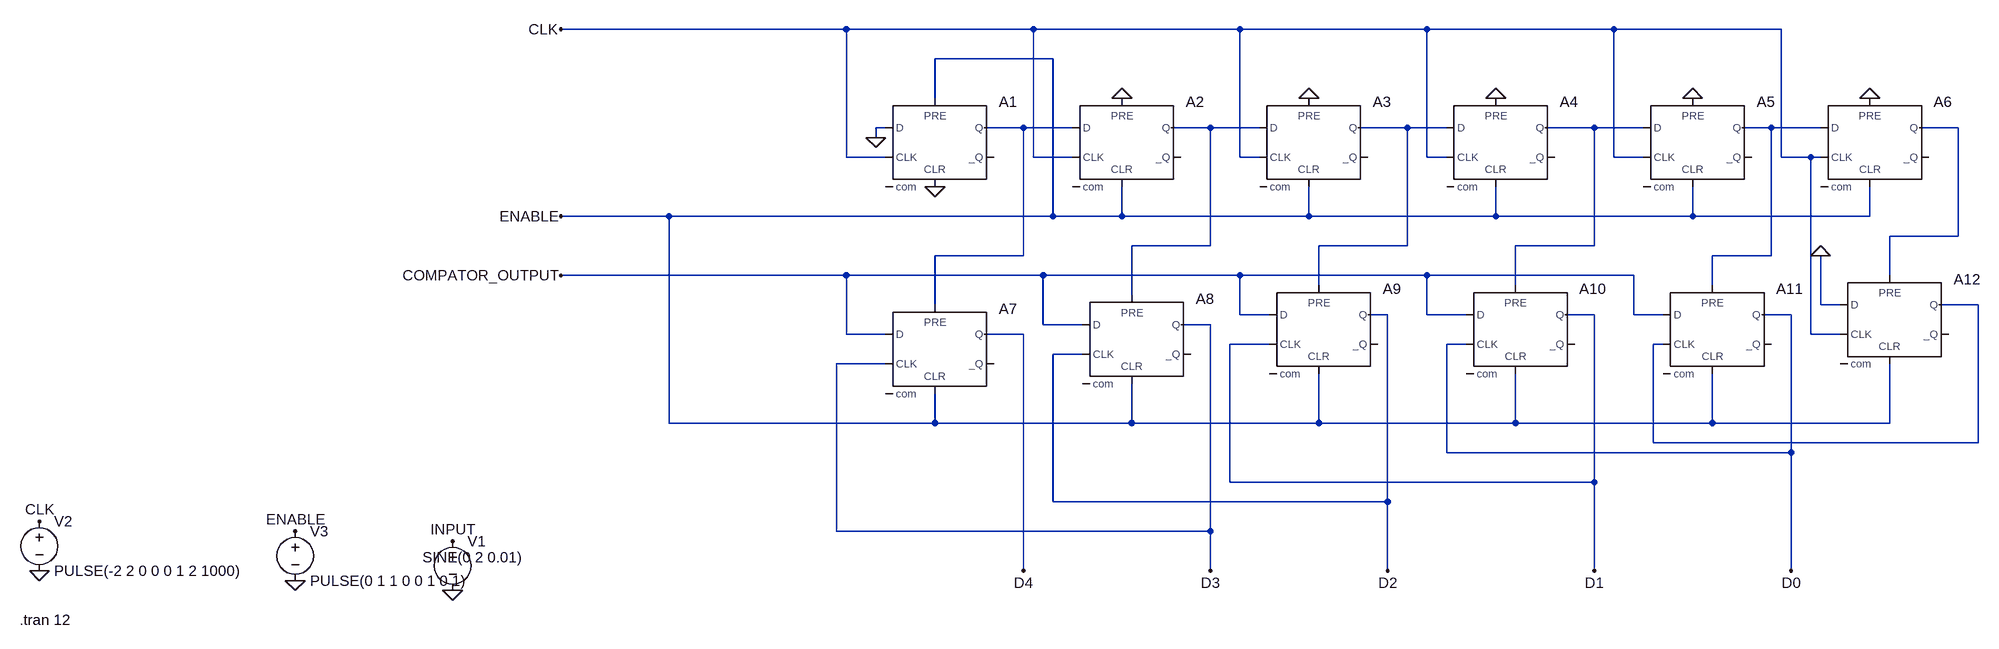
[diagram p0: schematic SAR.asc]
SAR.asc, the LTspice schematic file:
Version 4.1
SHEET 1 2516 848
WIRE 672 -128 208 -128
WIRE 976 -128 672 -128
WIRE 1312 -128 976 -128
WIRE 1616 -128 1312 -128
WIRE 1920 -128 1616 -128
WIRE 2192 -128 1920 -128
WIRE 1008 -80 816 -80
WIRE 816 -16 816 -80
WIRE 736 32 720 32
WIRE 960 32 896 32
WIRE 1040 32 960 32
WIRE 1264 32 1200 32
WIRE 1344 32 1264 32
WIRE 1584 32 1504 32
WIRE 1648 32 1584 32
WIRE 1888 32 1808 32
WIRE 1968 32 1888 32
WIRE 2176 32 2128 32
WIRE 2256 32 2176 32
WIRE 2480 32 2416 32
WIRE 720 48 720 32
WIRE 672 80 672 -128
WIRE 736 80 672 80
WIRE 976 80 976 -128
WIRE 1040 80 976 80
WIRE 1312 80 1312 -128
WIRE 1344 80 1312 80
WIRE 1616 80 1616 -128
WIRE 1648 80 1616 80
WIRE 1920 80 1920 -128
WIRE 1968 80 1920 80
WIRE 2192 80 2192 -128
WIRE 2240 80 2192 80
WIRE 2256 80 2240 80
WIRE 384 176 208 176
WIRE 1008 176 1008 -80
WIRE 1008 176 384 176
WIRE 1120 176 1120 128
WIRE 1120 176 1008 176
WIRE 1424 176 1424 128
WIRE 1424 176 1120 176
WIRE 1728 176 1728 128
WIRE 1728 176 1424 176
WIRE 2048 176 2048 128
WIRE 2048 176 1728 176
WIRE 2336 176 2336 128
WIRE 2336 176 2048 176
WIRE 2480 208 2480 32
WIRE 2480 208 2368 208
WIRE 1264 224 1264 32
WIRE 1264 224 1136 224
WIRE 1584 224 1584 32
WIRE 1584 224 1440 224
WIRE 1888 224 1888 32
WIRE 1888 224 1760 224
WIRE 960 240 960 32
WIRE 960 240 816 240
WIRE 2176 240 2176 32
WIRE 2176 240 2080 240
WIRE 672 272 208 272
WIRE 992 272 672 272
WIRE 1312 272 992 272
WIRE 1616 272 1312 272
WIRE 1952 272 1616 272
WIRE 2368 272 2368 208
WIRE 1440 288 1440 224
WIRE 1760 288 1760 224
WIRE 2080 288 2080 240
WIRE 1136 304 1136 224
WIRE 816 320 816 240
WIRE 2256 320 2256 240
WIRE 2288 320 2256 320
WIRE 2512 320 2448 320
WIRE 1312 336 1312 272
WIRE 1360 336 1312 336
WIRE 1552 336 1520 336
WIRE 1616 336 1616 272
WIRE 1680 336 1616 336
WIRE 1888 336 1840 336
WIRE 1952 336 1952 272
WIRE 2000 336 1952 336
WIRE 2208 336 2160 336
WIRE 992 352 992 272
WIRE 1056 352 992 352
WIRE 1264 352 1216 352
WIRE 672 368 672 272
WIRE 736 368 672 368
WIRE 960 368 896 368
WIRE 2240 368 2240 80
WIRE 2288 368 2240 368
WIRE 1360 384 1296 384
WIRE 1680 384 1648 384
WIRE 2000 384 1984 384
WIRE 1056 400 1008 400
WIRE 736 416 656 416
WIRE 384 512 384 176
WIRE 816 512 816 464
WIRE 816 512 384 512
WIRE 1136 512 1136 448
WIRE 1136 512 816 512
WIRE 1440 512 1440 432
WIRE 1440 512 1136 512
WIRE 1760 512 1760 432
WIRE 1760 512 1440 512
WIRE 2080 512 2080 432
WIRE 2080 512 1760 512
WIRE 2368 512 2368 416
WIRE 2368 512 2080 512
WIRE 1984 544 1984 384
WIRE 2512 544 2512 320
WIRE 2512 544 1984 544
WIRE 1648 560 1648 384
WIRE 2208 560 2208 336
WIRE 2208 560 1648 560
WIRE 1296 608 1296 384
WIRE 1888 608 1888 336
WIRE 1888 608 1296 608
WIRE 1008 640 1008 400
WIRE 1552 640 1552 336
WIRE 1552 640 1008 640
WIRE 656 688 656 416
WIRE 1264 688 1264 352
WIRE 1264 688 656 688
WIRE 960 752 960 368
WIRE 1264 752 1264 688
WIRE 1552 752 1552 640
WIRE 1888 752 1888 608
WIRE 2208 752 2208 560
FLAG 960 752 D4
FLAG 1264 752 D3
FLAG 1552 752 D2
FLAG 1888 752 D1
FLAG 2208 752 D0
FLAG 208 -128 CLK
FLAG 208 176 ENABLE
FLAG 208 272 COMPATOR_OUTPUT
FLAG 32 704 INPUT
FLAG 32 784 0
FLAG 816 128 0
FLAG 1120 -16 0
FLAG 1424 -16 0
FLAG 2336 -16 0
FLAG 2048 -16 0
FLAG 1728 -16 0
FLAG 2256 240 0
FLAG 720 48 0
FLAG -640 752 0
FLAG -224 768 0
FLAG -640 672 CLK
FLAG -224 688 ENABLE
SYMBOL Digital\\dflop 816 -16 R0
SYMATTR InstName A1
SYMBOL Digital\\dflop 1120 -16 R0
SYMATTR InstName A2
SYMBOL Digital\\dflop 1424 -16 R0
SYMATTR InstName A3
SYMBOL Digital\\dflop 1728 -16 R0
SYMATTR InstName A4
SYMBOL Digital\\dflop 2048 -16 R0
SYMATTR InstName A5
SYMBOL Digital\\dflop 2336 -16 R0
SYMATTR InstName A6
SYMBOL Digital\\dflop 816 320 R0
SYMATTR InstName A7
SYMBOL Digital\\dflop 1136 304 R0
SYMATTR InstName A8
SYMBOL Digital\\dflop 1440 288 R0
SYMATTR InstName A9
SYMBOL Digital\\dflop 1760 288 R0
SYMATTR InstName A10
SYMBOL Digital\\dflop 2080 288 R0
SYMATTR InstName A11
SYMBOL Digital\\dflop 2368 272 R0
SYMATTR InstName A12
SYMBOL voltage 32 688 R0
WINDOW 3 31 58 Bottom 2
WINDOW 123 0 0 Left 0
WINDOW 39 0 0 Left 0
SYMATTR Value SINE(0 2 0.01)
SYMATTR InstName V1
SYMBOL voltage -640 656 R0
WINDOW 123 0 0 Left 0
WINDOW 39 0 0 Left 0
SYMATTR InstName V2
SYMATTR Value PULSE(-2 2 0 0 0 1 2 1000)
SYMBOL voltage -224 672 R0
WINDOW 123 0 0 Left 0
WINDOW 39 0 0 Left 0
SYMATTR InstName V3
SYMATTR Value PULSE(0 1 1 0 0 1 0 1)
TEXT -672 832 Left 2 !.tran 12

The netlist it stands for:
* SAR.asc
A1 0 0 CLK ENABLE 0 0 N001 0 DFLOP
A2 N001 0 CLK 0 ENABLE 0 N002 0 DFLOP
A3 N002 0 CLK 0 ENABLE 0 N003 0 DFLOP
A4 N003 0 CLK 0 ENABLE 0 N004 0 DFLOP
A5 N004 0 CLK 0 ENABLE 0 N005 0 DFLOP
A6 N005 0 CLK 0 ENABLE 0 N006 0 DFLOP
A7 COMPATOR_OUTPUT 0 D3 N001 ENABLE 0 D4 0 DFLOP
A8 COMPATOR_OUTPUT 0 D2 N002 ENABLE 0 D3 0 DFLOP
A9 COMPATOR_OUTPUT 0 D1 N003 ENABLE 0 D2 0 DFLOP
A10 COMPATOR_OUTPUT 0 D0 N004 ENABLE 0 D1 0 DFLOP
A11 COMPATOR_OUTPUT 0 N007 N005 ENABLE 0 D0 0 DFLOP
A12 0 0 CLK N006 ENABLE 0 N007 0 DFLOP
V1 INPUT 0 SINE(0 2 0.01)
V2 CLK 0 PULSE(-2 2 0 0 0 1 2 1000)
V3 ENABLE 0 PULSE(0 1 1 0 0 1 0 1)
.tran 12
.backanno
.end